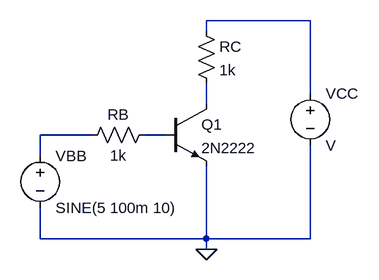
[diagram p0: schematic bjt.asc]
bjt.asc, the LTspice schematic file:
Version 4.1
SHEET 1 880 680
WIRE 384 -64 224 -64
WIRE 224 -48 224 -64
WIRE 384 48 384 -64
WIRE 224 64 224 32
WIRE 48 112 -32 112
WIRE 160 112 128 112
WIRE -32 144 -32 112
WIRE -32 272 -32 224
WIRE 224 272 224 160
WIRE 224 272 -32 272
WIRE 384 272 384 128
WIRE 384 272 224 272
WIRE 224 288 224 272
FLAG 224 288 0
SYMBOL npn 160 64 R0
SYMATTR InstName Q1
SYMATTR Value 2N2222
SYMBOL voltage 384 32 R0
SYMATTR InstName VCC
SYMBOL voltage -32 128 R0
WINDOW 123 0 0 Left 0
WINDOW 39 0 0 Left 0
SYMATTR InstName VBB
SYMATTR Value SINE(5 100m 10)
SYMBOL res 208 -64 R0
SYMATTR InstName RC
SYMATTR Value 1k
SYMBOL res 144 96 R90
WINDOW 0 0 56 VBottom 2
WINDOW 3 32 56 VTop 2
SYMATTR InstName RB
SYMATTR Value 1k

The netlist it stands for:
* bjt.asc
Q1 N002 N004 0 0 2N2222
VCC N001 0 V
VBB N003 0 SINE(5 100m 10)
RC N001 N002 1k
RB N004 N003 1k
.model NPN NPN
.model PNP PNP
.lib standard.bjt
.backanno
.end